# Altium project Lumiere_ctrl_altium.PrjPcb
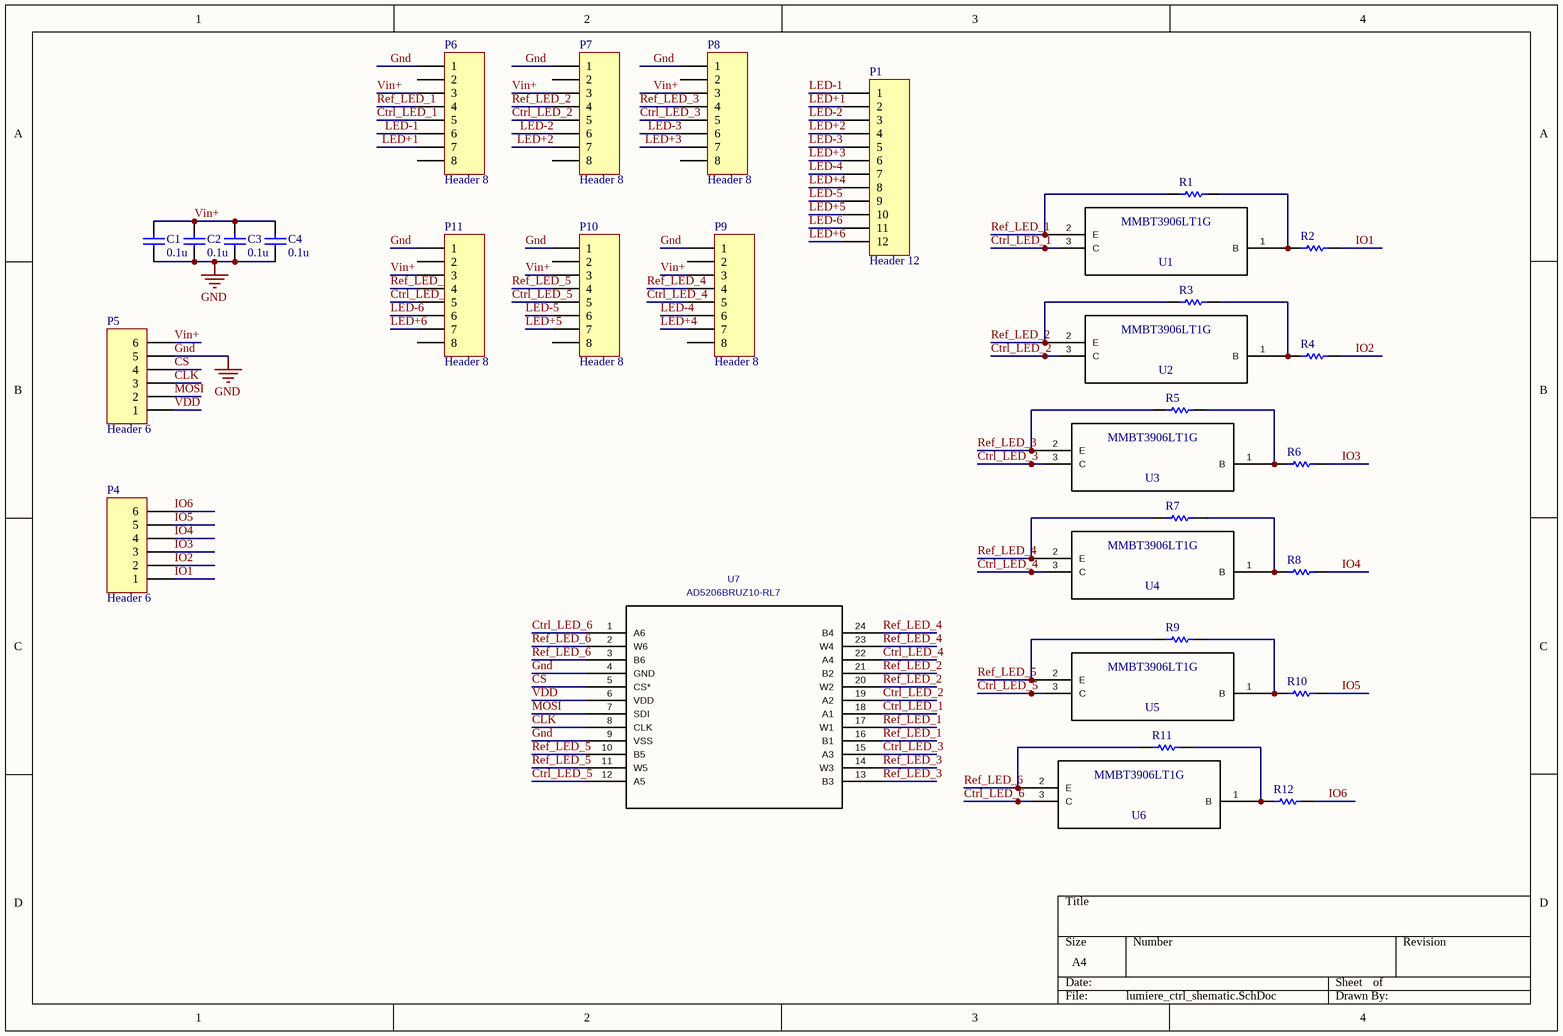
[diagram p0: lumiere_ctrl_shematic.SchDoc]
1 sheet, 32 parts. Net scope: global (net labels, ports and power ports of the same name join across sheets).
Board file: ctrl_lumier_pcb_backup.PcbDoc

## Sheet lumiere_ctrl_shematic.SchDoc
size A4

### Parts
C1  value 0.1u  [CC1206N]  (hidden comment: CapSMD)
C2  value 0.1u  [CC1206N]  (hidden comment: CapSMD)
C3  value 0.1u  [CC1206N]  (hidden comment: CapSMD)
C4  value 0.1u  [CC1206N]  (hidden comment: CapSMD)
P1  Header 12  [Terminal block 12 pos]
P4  Header 6  [Terminal block 6 pos]
P5  Header 6  [Terminal block 6 pos]
P6  Header 8  [HDR1X8]
P7  Header 8  [HDR1X8]
P8  Header 8  [HDR1X8]
P9  Header 8  [HDR1X8]
P10  Header 8  [HDR1X8]
P11  Header 8  [HDR1X8]
R1  ResSMD  [STA_RMCF1206]  (value not drawn)
R2  ResSMD  [STA_RMCF1206]  (value not drawn)
R3  ResSMD  [STA_RMCF1206]  (value not drawn)
R4  ResSMD  [STA_RMCF1206]  (value not drawn)
R5  ResSMD  [STA_RMCF1206]  (value not drawn)
R6  ResSMD  [STA_RMCF1206]  (value not drawn)
R7  ResSMD  [STA_RMCF1206]  (value not drawn)
R8  ResSMD  [STA_RMCF1206]  (value not drawn)
R9  ResSMD  [STA_RMCF1206]  (value not drawn)
R10  ResSMD  [STA_RMCF1206]  (value not drawn)
R11  ResSMD  [STA_RMCF1206]  (value not drawn)
R12  ResSMD  [STA_RMCF1206]  (value not drawn)
U1  MMBT3906LT1G  [SOT-23]
U2  MMBT3906LT1G  [SOT-23]
U3  MMBT3906LT1G  [SOT-23]
U4  MMBT3906LT1G  [SOT-23]
U5  MMBT3906LT1G  [SOT-23]
U6  MMBT3906LT1G  [SOT-23]
U7  AD5206BRUZ10-RL7  [RU_24]

### Nets
Gnd: C1.1 C2.1 C3.1 C4.1 P5.5 P6.1 P7.1 P8.1 P9.1 P10.1 P11.1 U7.4(GND) U7.9(VSS)
CLK: P5.3 U7.8(CLK)
CS: P5.4 U7.5(CS*)
Ctrl_LED_1: P6.5 U1.3(C) U7.18(A1)
Ctrl_LED_2: P7.5 U2.3(C) U7.19(A2)
Ctrl_LED_3: P8.5 U3.3(C) U7.15(A3)
Ctrl_LED_4: P9.5 U4.3(C) U7.22(A4)
Ctrl_LED_5: P10.5 U5.3(C) U7.12(A5)
Ctrl_LED_6: P11.5 U6.3(C) U7.1(A6)
IO1: P4.1 R2.1
IO2: P4.2 R4.1
IO3: P4.3 R6.1
IO4: P4.4 R8.1
IO5: P4.5 R10.1
IO6: P4.6 R12.1
LED+1: P1.2 P6.7
LED+2: P1.4 P7.7
LED+3: P1.6 P8.7
LED+4: P1.8 P9.7
LED+5: P1.10 P10.7
LED+6: P1.12 P11.7
LED-1: P1.1 P6.6
LED-2: P1.3 P7.6
LED-3: P1.5 P8.6
LED-4: P1.7 P9.6
LED-5: P1.9 P10.6
LED-6: P1.11 P11.6
MOSI: P5.2 U7.7(SDI)
Ref_LED_1: P6.4 R1.2 U1.2(E) U7.16(B1) U7.17(W1)
Ref_LED_2: P7.4 R3.2 U2.2(E) U7.20(W2) U7.21(B2)
Ref_LED_3: P8.4 R5.2 U3.2(E) U7.13(B3) U7.14(W3)
Ref_LED_4: P9.4 R7.2 U4.2(E) U7.23(W4) U7.24(B4)
Ref_LED_5: P10.4 R9.2 U5.2(E) U7.10(B5) U7.11(W5)
Ref_LED_6: P11.4 R11.2 U6.2(E) U7.2(W6) U7.3(B6)
VDD: P5.1 U7.6(VDD)
Vin+: C1.2 C2.2 C3.2 C4.2 P5.6 P6.3 P7.3 P8.3 P9.3 P10.3 P11.3
NetR1_1: R1.1 R2.2 U1.1(B)
NetR3_1: R3.1 R4.2 U2.1(B)
NetR5_1: R5.1 R6.2 U3.1(B)
NetR7_1: R7.1 R8.2 U4.1(B)
NetR9_1: R9.1 R10.2 U5.1(B)
NetR11_1: R11.1 R12.2 U6.1(B)

Not connected (* = marked no-connect by the designer): P6 2 8; P7 2 8; P8 2 8; P9 2 8; P10 2 8; P11 2 8

### Library data of the parts
C1-C4 = CapSMD: Capacitor; Voltage: 50V; Type: Ceramic; Package: 1206
P1 = Header 12: Header, 12-Pin; LatestRevisionDate: 17-Jul-2002; LatestRevisionNote: Re-released for DXP Platform.; Publisher: Altium Limited
P4 P5 = Header 6: Header, 6-Pin; LatestRevisionDate: 17-Jul-2002; LatestRevisionNote: Re-released for DXP Platform.; Publisher: Altium Limited
P6-P11 = Header 8: Header, 8-Pin; LatestRevisionDate: 17-Jul-2002; LatestRevisionNote: Re-released for DXP Platform.; Publisher: Altium Limited
U1-U6 = MMBT3906LT1G: C: Copyright (C) 2015 Accelerated Designs. All rights reserved; Vendor: ON Semiconductor; Built_By: EMA_UL_Team; Value: MMBT3906LT1G; Manufacturer_Part_Number: MMBT3906LT1G
U7 = AD5206BRUZ10-RL7: C: Copyright (C) 2015 Accelerated Designs. All rights reserved; Vendor: Analog Devices Inc; Built_By: EMA_UL_Team; Value: AD5206BRUZ10-RL7; Manufacturer_Part_Number: AD5206BRUZ10-RL7
R1-R12 = ResSMD: Precision: *; Package: 1206; Puissance: *